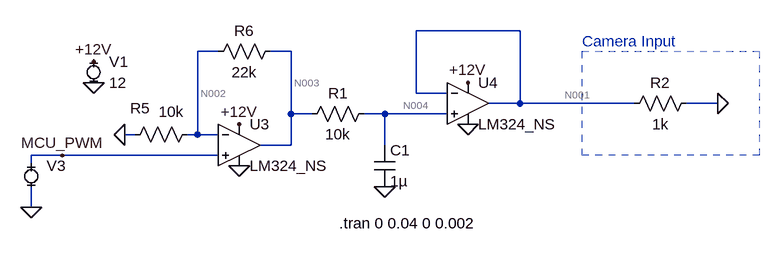
[diagram p0: schematic PWM_To_0-10V_Converter.asc]
* PWM_To_0-10V_Converter.asc
V1 +12V 0 12
R1 N004 N003 10k
C1 N004 0 1µ
V3 MCU_PWM 0 PULSE(0 3.3 0 0 0 0.19e-3 0.2e-3)
R5 N002 0 10k
R6 N002 N003 22k
R2 0 N001 1k
* U3: LM324_NS (symbol EXTRA\ExtraOpamps\LM324_NS not available, pins judged from their places): In+=MCU_PWM In-=N002 V+=+12V V-=0 OUT=N003
* U4: LM324_NS (symbol EXTRA\ExtraOpamps\LM324_NS not available, pins judged from their places): In+=N004 In-=N001 V+=+12V V-=0 OUT=N001
.tran 0 0.04 0 0.002
* Camera Input
.backanno
.end

* Results of the author's LTspice run, read from the files saved beside the schematic
* Operating Point, zero values left out:
*   V(+12v) = 12 V
*   V(n004) = 38.65 mV
*   V(n003) = 38.05 mV
*   V(n002) = 12.02 mV
*   V(n001) = 44.89 mV
*   I(R2) = -44.89 µA
*   I(R6) = -1.183 µA
*   I(R5) = 1.202 µA
*   I(R1) = 60.18 nA
*   I(V3) = 70.87 nA
*   I(V1) = -38.14 µA
*   Ix(u3:1) = -70.87 nA
*   Ix(u3:2) = -19.06 nA
*   Ix(u3:99) = 2.106 µA
*   Ix(u3:50) = -893.5 nA
*   Ix(u3:28) = -1.123 µA
*   Ix(u4:1) = -60.18 nA
*   Ix(u4:2) = -29.75 nA
*   Ix(u4:99) = 36.03 µA
*   Ix(u4:50) = 8.921 µA
*   Ix(u4:28) = -44.86 µA
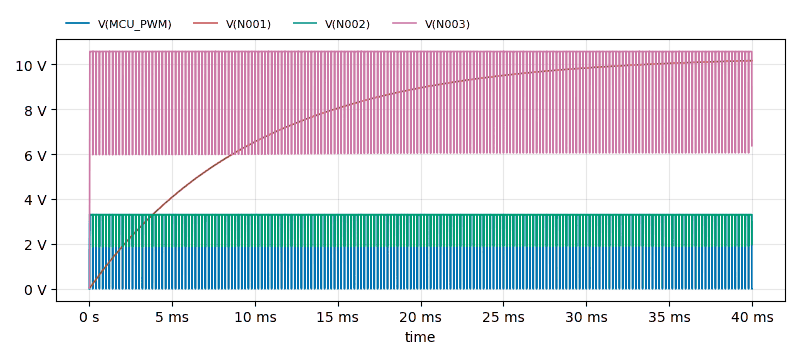
[diagram p1: Transient Analysis of PWM_To_0-10V_Converter.asc, plotted from the saved traces]
* Transient Analysis, 1 run:
*   V(MCU_PWM): min 0 V, max 3.3 V, average 3.151 V, rms 3.222 V, last 0 V
*   V(N001): min 44.89 mV, max 10.16 V, average 7.815 V, rms 8.244 V, last 10.16 V
*   V(N002): min 12.02 mV, max 3.305 V, average 3.232 V, rms 3.242 V, last 1.977 V
*   V(N003): min 38.05 mV, max 10.58 V, average 10.34 V, rms 10.37 V, last 6.37 V